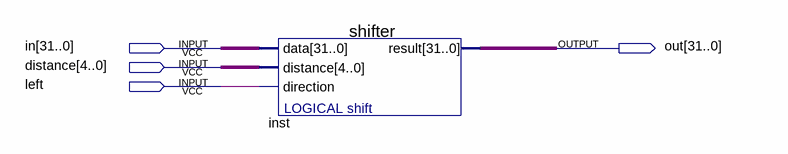
[diagram p0: schematic sheet]
// Quartus schematic shift.bdf as structural Verilog: 1 symbols, 4 pins
module shift (
  input  [31:0] in,
  input  [4:0] distance,
  input  left,
  output [31:0] out
);

  shifter inst (.data(in), .distance(distance), .direction(left), .result(out));
endmodule
